# Altium schematic sheet MCU.SchDoc
size A
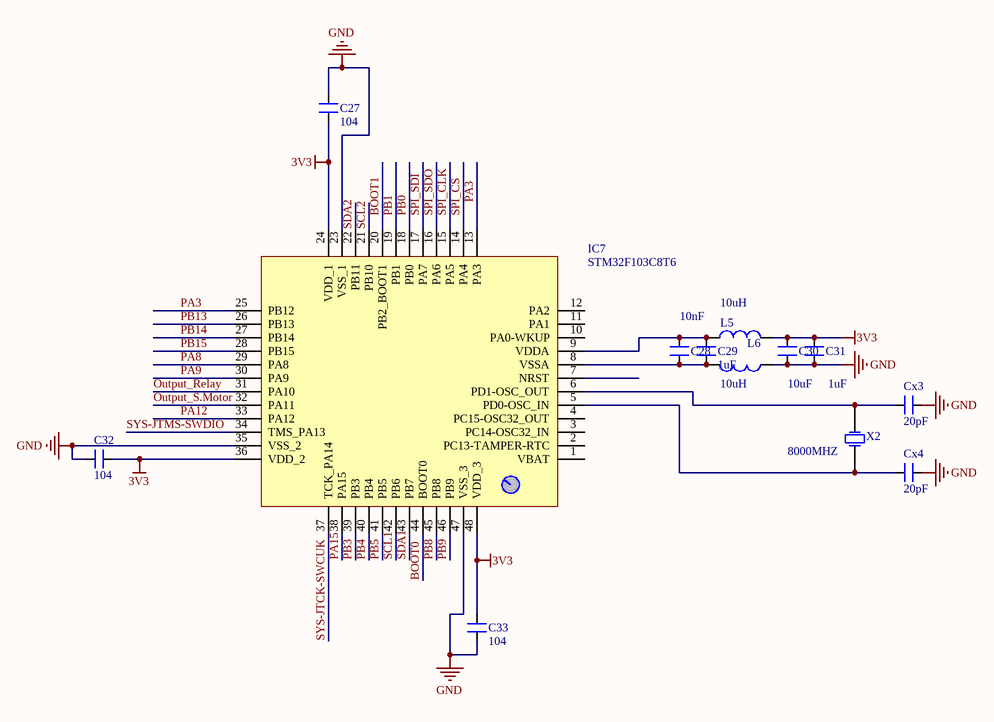
[diagram p0: MCU.SchDoc]

## Parts
C27  104  [CN2]
C28  10nF  [CN2]
C29  1uF  [CN2]
C30  10uF  [CN2]
C31  1uF  [CN2]
C32  104  [CN2]
C33  104  [CN2]
Cx3  20pF  [CN1]
Cx4  20pF  [CN1]
IC7  STM32F103C8T6  [STM32F103C8T6]
L5  10uH  [L/0.4]
L6  10uH  [L/0.4]
X2  8000MHZ  [XTAL]

## Nets
3V3: C27.1 C30.1 C31.1 C32.2 C33.2 IC7.24(VDD_1) IC7.36(VDD_2) IC7.48(VDD_3) L5.2
GND: C27.2 C30.2 C31.2 C32.1 C33.1 Cx3.1 Cx4.1 IC7.23(VSS_1) IC7.35(VSS_2) IC7.47(VSS_3) L6.1
BOOT0: IC7.44(BOOT0)
BOOT1: IC7.20(PB2_BOOT1)
Output_Relay: IC7.31(PA10)
Output_S.Motor: IC7.32(PA11)
PA3: IC7.13(PA3) IC7.25(PB12)
PA8: IC7.29(PA8)
PA9: IC7.30(PA9)
PA12: IC7.33(PA12)
PA15: IC7.38(PA15)
PB0: IC7.18(PB0)
PB1: IC7.19(PB1)
PB3: IC7.39(PB3)
PB4: IC7.40(PB4)
PB5: IC7.41(PB5)
PB8: IC7.45(PB8)
PB9: IC7.46(PB9)
PB13: IC7.26(PB13)
PB14: IC7.27(PB14)
PB15: IC7.28(PB15)
SCL1: IC7.42(PB6)
SCL2: IC7.21(PB10)
SDA1: IC7.43(PB7)
SDA2: IC7.22(PB11)
SPI_CLK: IC7.15(PA5)
SPI_CS: IC7.14(PA4)
SPI_SDI: IC7.17(PA7)
SPI_SDO: IC7.16(PA6)
SYS-JTCK-SWCUK: IC7.37(TCK_PA14)
SYS-JTMS-SWDIO: IC7.34(TMS_PA13)
NetC28_1: C28.1 C29.1 IC7.9(VDDA) L5.1
NetC28_2: C28.2 C29.2 IC7.8(VSSA) L6.2
NetCx3_2: Cx3.2 IC7.6(PD1-OSC_OUT) X2.2(OSC2)
NetCx4_2: Cx4.2 IC7.5(PD0-OSC_IN) X2.1(OSC1)

Not connected (* = marked no-connect by the designer): IC7 1(VBAT) 2(PC13-TAMPER-RTC) 3(PC14-OSC32_IN) 4(PC15-OSC32_OUT) 7(NRST) 10(PA0-WKUP) 11(PA1) 12(PA2)

## Library data of the parts
C27-C33 = CN2: Cap np 104 => 105pF; Value: 0.1uF
Cx3 Cx4 = CN0: Cremic For Xtal 1pF => 100pF; Value: 33pF
L5 L6 = L1: Inductor; Value: 150 mH
X2 = XTAL: Crystal Oscillator; Published: 8-Jun-2000; LatestRevisionDate: 17-Jul-2002; LatestRevisionNote: Re-released for DXP Platform.; PackageReference: R38; Publisher: Altium Limited